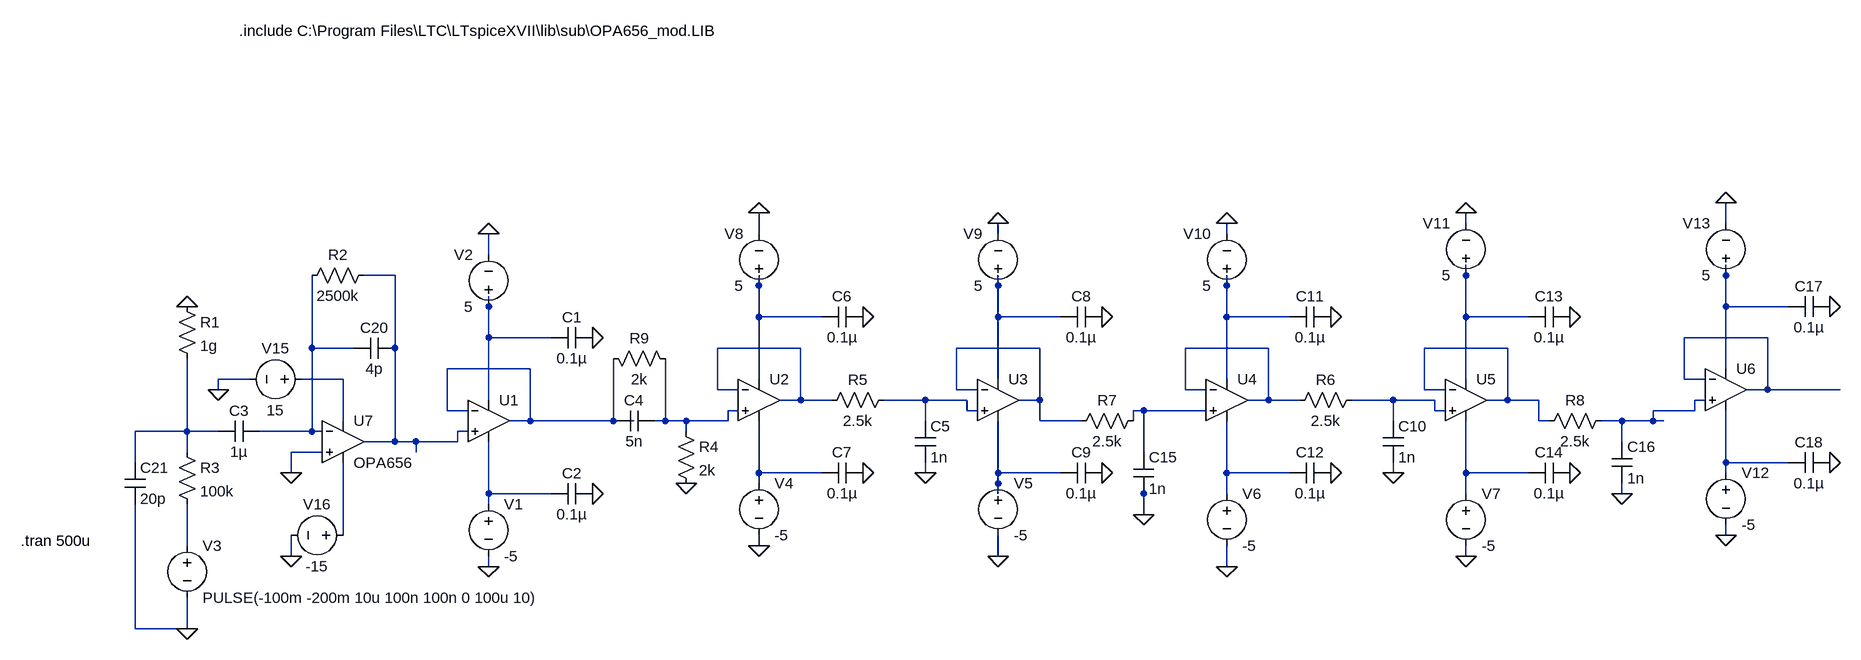
[diagram p0: schematic RF_CSP_pulseshaper.asc]
RF_CSP_pulseshaper.asc, the LTspice schematic file:
Version 4
SHEET 1 2596 1140
WIRE 1648 -224 1648 -240
WIRE 2048 -224 2048 -256
WIRE 560 -208 560 -240
WIRE 928 -208 928 -224
WIRE 1280 -208 1280 -224
WIRE 144 -176 144 -208
WIRE 0 -144 -48 -144
WIRE 1648 -144 1648 -160
WIRE 2048 -144 2048 -160
WIRE 560 -128 560 -144
WIRE 928 -128 928 -144
WIRE 1280 -128 1280 -144
WIRE 144 -96 144 -112
WIRE 2048 -96 2048 -144
WIRE 2144 -96 2048 -96
WIRE 560 -80 560 -128
WIRE 656 -80 560 -80
WIRE 928 -80 928 -128
WIRE 1024 -80 928 -80
WIRE 1280 -80 1280 -128
WIRE 1376 -80 1280 -80
WIRE 1648 -80 1648 -144
WIRE 1744 -80 1648 -80
WIRE 144 -48 144 -96
WIRE 240 -48 144 -48
WIRE 2112 -48 1984 -48
WIRE -128 -32 -128 -144
WIRE -64 -32 -128 -32
WIRE 0 -32 0 -144
WIRE 624 -32 496 -32
WIRE 992 -32 864 -32
WIRE 1344 -32 1216 -32
WIRE 1712 -32 1584 -32
WIRE 208 0 80 0
WIRE 2048 0 2048 -96
WIRE -224 16 -272 16
WIRE -80 16 -144 16
WIRE 560 16 560 -80
WIRE 928 16 928 -80
WIRE 1280 16 1280 -80
WIRE 1648 16 1648 -80
WIRE 1984 16 1984 -48
WIRE 2016 16 1984 16
WIRE -272 32 -272 16
WIRE 496 32 496 -32
WIRE 528 32 496 32
WIRE 864 32 864 -32
WIRE 896 32 864 32
WIRE 1216 32 1216 -32
WIRE 1248 32 1216 32
WIRE 1584 32 1584 -32
WIRE 1616 32 1584 32
WIRE 2112 32 2112 -48
WIRE 2112 32 2080 32
WIRE 2224 32 2112 32
WIRE 144 48 144 -48
WIRE 624 48 624 -32
WIRE 624 48 592 48
WIRE 672 48 624 48
WIRE 816 48 752 48
WIRE 880 48 816 48
WIRE 992 48 992 -32
WIRE 992 48 960 48
WIRE 1344 48 1344 -32
WIRE 1344 48 1312 48
WIRE 1392 48 1344 48
WIRE 1536 48 1472 48
WIRE 1600 48 1536 48
WIRE 1712 48 1712 -32
WIRE 1712 48 1680 48
WIRE 1760 48 1712 48
WIRE 2016 48 2000 48
WIRE 80 64 80 0
WIRE 112 64 80 64
WIRE 528 64 512 64
WIRE 880 64 880 48
WIRE 896 64 880 64
WIRE 1152 64 1136 64
WIRE 1248 64 1152 64
WIRE 1600 64 1600 48
WIRE 1616 64 1600 64
WIRE 2000 64 2000 48
WIRE 2000 64 1936 64
WIRE -80 80 -80 16
WIRE 208 80 208 0
WIRE 208 80 176 80
WIRE 336 80 336 -16
WIRE 336 80 208 80
WIRE 368 80 336 80
WIRE 416 80 416 -16
WIRE 416 80 400 80
WIRE 448 80 416 80
WIRE 512 80 512 64
WIRE 512 80 448 80
WIRE 816 80 816 48
WIRE 992 80 992 48
WIRE 1056 80 992 80
WIRE 1136 80 1136 64
WIRE 1536 80 1536 48
WIRE 1760 80 1760 48
WIRE 1776 80 1760 80
WIRE 1888 80 1856 80
WIRE 1936 80 1936 64
WIRE 1936 80 1888 80
WIRE 1952 80 1936 80
WIRE -320 96 -320 -16
WIRE -320 96 -400 96
WIRE -272 96 -320 96
WIRE -128 96 -128 -32
WIRE -128 96 -208 96
WIRE -112 96 -128 96
WIRE 112 96 96 96
WIRE 448 96 448 80
WIRE 0 112 0 -32
WIRE 0 112 -48 112
WIRE 32 112 0 112
WIRE 96 112 96 96
WIRE 96 112 32 112
WIRE 1888 112 1888 80
WIRE -320 128 -320 96
WIRE -112 128 -160 128
WIRE 32 128 32 112
WIRE 1152 128 1152 64
WIRE -400 144 -400 96
WIRE 2048 144 2048 64
WIRE 2144 144 2048 144
WIRE -160 160 -160 128
WIRE 560 160 560 80
WIRE 656 160 560 160
WIRE 816 160 816 144
WIRE 928 160 928 80
WIRE 1024 160 928 160
WIRE 1280 160 1280 80
WIRE 1376 160 1280 160
WIRE 1536 160 1536 144
WIRE 1648 160 1648 80
WIRE 1744 160 1648 160
WIRE 2048 160 2048 144
WIRE 560 176 560 160
WIRE 928 176 928 160
WIRE 144 192 144 112
WIRE 240 192 144 192
WIRE 928 192 928 176
WIRE 1152 192 1152 176
WIRE 1280 192 1280 160
WIRE 1648 192 1648 160
WIRE 1888 192 1888 176
WIRE 144 208 144 192
WIRE 1152 224 1152 192
WIRE -80 256 -80 144
WIRE 2048 256 2048 240
WIRE -320 272 -320 208
WIRE 560 272 560 256
WIRE -160 288 -160 256
WIRE 928 288 928 256
WIRE 1648 288 1648 272
WIRE 144 304 144 288
WIRE 1280 304 1280 272
WIRE -400 400 -400 208
WIRE -320 400 -320 352
WIRE -320 400 -400 400
FLAG 720 -80 0
FLAG 720 160 0
FLAG 816 160 0
FLAG 448 176 0
FLAG 1088 -80 0
FLAG 1440 -80 0
FLAG 1440 160 0
FLAG 1536 160 0
FLAG 1808 -80 0
FLAG 1808 160 0
FLAG 560 272 0
FLAG 928 288 0
FLAG 1280 304 0
FLAG 1648 288 0
FLAG 928 -224 0
FLAG 1280 -224 0
FLAG 1648 -240 0
FLAG 560 -240 0
FLAG 1088 160 0
FLAG 1152 224 0
FLAG 1888 192 0
FLAG 304 -48 0
FLAG 304 192 0
FLAG 144 304 0
FLAG 144 -208 0
FLAG -320 400 0
FLAG -320 -96 0
FLAG -160 160 0
FLAG -272 32 0
FLAG -160 288 0
FLAG 2208 -96 0
FLAG 2208 144 0
FLAG 2048 256 0
FLAG 2048 -256 0
SYMBOL cap 400 64 R90
WINDOW 0 0 32 VBottom 2
WINDOW 3 32 32 VTop 2
SYMATTR InstName C4
SYMATTR Value 5n
SYMBOL res 432 80 R0
SYMATTR InstName R4
SYMATTR Value 2k
SYMBOL res 768 32 R90
WINDOW 0 0 56 VBottom 2
WINDOW 3 32 56 VTop 2
SYMATTR InstName R5
SYMATTR Value 2.5k
SYMBOL cap 800 80 R0
SYMATTR InstName C5
SYMATTR Value 1n
SYMBOL cap 720 -96 R90
WINDOW 0 0 32 VBottom 2
WINDOW 3 32 32 VTop 2
SYMATTR InstName C6
SYMATTR Value 0.1µ
SYMBOL cap 720 144 R90
WINDOW 0 0 32 VBottom 2
WINDOW 3 32 32 VTop 2
SYMATTR InstName C7
SYMATTR Value 0.1µ
SYMBOL OpAmps\\UniversalOpamp2 560 48 R0
SYMATTR InstName U2
SYMBOL cap 1088 -96 R90
WINDOW 0 0 32 VBottom 2
WINDOW 3 32 32 VTop 2
SYMATTR InstName C8
SYMATTR Value 0.1µ
SYMBOL cap 1088 144 R90
WINDOW 0 0 32 VBottom 2
WINDOW 3 32 32 VTop 2
SYMATTR InstName C9
SYMATTR Value 0.1µ
SYMBOL OpAmps\\UniversalOpamp2 928 48 R0
SYMATTR InstName U3
SYMBOL res 1488 32 R90
WINDOW 0 0 56 VBottom 2
WINDOW 3 32 56 VTop 2
SYMATTR InstName R6
SYMATTR Value 2.5k
SYMBOL cap 1520 80 R0
SYMATTR InstName C10
SYMATTR Value 1n
SYMBOL cap 1440 -96 R90
WINDOW 0 0 32 VBottom 2
WINDOW 3 32 32 VTop 2
SYMATTR InstName C11
SYMATTR Value 0.1µ
SYMBOL cap 1440 144 R90
WINDOW 0 0 32 VBottom 2
WINDOW 3 32 32 VTop 2
SYMATTR InstName C12
SYMATTR Value 0.1µ
SYMBOL OpAmps\\UniversalOpamp2 1280 48 R0
SYMATTR InstName U4
SYMBOL cap 1808 -96 R90
WINDOW 0 0 32 VBottom 2
WINDOW 3 32 32 VTop 2
SYMATTR InstName C13
SYMATTR Value 0.1µ
SYMBOL cap 1808 144 R90
WINDOW 0 0 32 VBottom 2
WINDOW 3 32 32 VTop 2
SYMATTR InstName C14
SYMATTR Value 0.1µ
SYMBOL OpAmps\\UniversalOpamp2 1648 48 R0
SYMATTR InstName U5
SYMBOL voltage 560 160 R0
WINDOW 123 0 0 Left 0
WINDOW 39 0 0 Left 0
SYMATTR InstName V4
SYMATTR Value -5
SYMBOL voltage 928 160 R0
WINDOW 123 0 0 Left 0
WINDOW 39 0 0 Left 0
SYMATTR InstName V5
SYMATTR Value -5
SYMBOL voltage 1280 176 R0
WINDOW 123 0 0 Left 0
WINDOW 39 0 0 Left 0
SYMATTR InstName V6
SYMATTR Value -5
SYMBOL voltage 1648 176 R0
WINDOW 123 0 0 Left 0
WINDOW 39 0 0 Left 0
SYMATTR InstName V7
SYMATTR Value -5
SYMBOL voltage 560 -112 R180
WINDOW 0 24 96 Left 2
WINDOW 3 24 16 Left 2
WINDOW 123 0 0 Left 0
WINDOW 39 0 0 Left 0
SYMATTR InstName V8
SYMATTR Value 5
SYMBOL voltage 928 -112 R180
WINDOW 0 24 96 Left 2
WINDOW 3 24 16 Left 2
WINDOW 123 0 0 Left 0
WINDOW 39 0 0 Left 0
SYMATTR InstName V9
SYMATTR Value 5
SYMBOL voltage 1280 -112 R180
WINDOW 0 24 96 Left 2
WINDOW 3 24 16 Left 2
WINDOW 123 0 0 Left 0
WINDOW 39 0 0 Left 0
SYMATTR InstName V10
SYMATTR Value 5
SYMBOL voltage 1648 -128 R180
WINDOW 0 24 96 Left 2
WINDOW 3 24 16 Left 2
WINDOW 123 0 0 Left 0
WINDOW 39 0 0 Left 0
SYMATTR InstName V11
SYMATTR Value 5
SYMBOL res 1152 64 R90
WINDOW 0 0 56 VBottom 2
WINDOW 3 32 56 VTop 2
SYMATTR InstName R7
SYMATTR Value 2.5k
SYMBOL cap 1136 128 R0
SYMATTR InstName C15
SYMATTR Value 1n
SYMBOL cap 1872 112 R0
SYMATTR InstName C16
SYMATTR Value 1n
SYMBOL res 1872 64 R90
WINDOW 0 0 56 VBottom 2
WINDOW 3 32 56 VTop 2
SYMATTR InstName R8
SYMATTR Value 2.5k
SYMBOL cap 304 -64 R90
WINDOW 0 0 32 VBottom 2
WINDOW 3 32 32 VTop 2
SYMATTR InstName C1
SYMATTR Value 0.1µ
SYMBOL cap 304 176 R90
WINDOW 0 0 32 VBottom 2
WINDOW 3 32 32 VTop 2
SYMATTR InstName C2
SYMATTR Value 0.1µ
SYMBOL OpAmps\\UniversalOpamp2 144 80 R0
SYMATTR InstName U1
SYMBOL voltage 144 192 R0
WINDOW 123 0 0 Left 0
WINDOW 39 0 0 Left 0
SYMATTR InstName V1
SYMATTR Value -5
SYMBOL voltage 144 -80 R180
WINDOW 0 24 96 Left 2
WINDOW 3 24 16 Left 2
WINDOW 123 0 0 Left 0
WINDOW 39 0 0 Left 0
SYMATTR InstName V2
SYMATTR Value 5
SYMBOL voltage -320 256 R0
WINDOW 123 0 0 Left 0
WINDOW 39 0 0 Left 0
SYMATTR InstName V3
SYMATTR Value PULSE(-100m -200m 10u 100n 100n 0 100u 10)
SYMBOL res -336 -112 R0
SYMATTR InstName R1
SYMATTR Value 1g
SYMBOL OpAmps\\opamp2 -80 48 R0
SYMATTR InstName U7
SYMATTR Value OPA656
SYMBOL cap -208 80 R90
WINDOW 0 0 32 VBottom 2
WINDOW 3 32 32 VTop 2
SYMATTR InstName C3
SYMATTR Value 1µ
SYMBOL cap 0 -48 R90
WINDOW 0 0 32 VBottom 2
WINDOW 3 32 32 VTop 2
SYMATTR InstName C20
SYMATTR Value 4p
SYMBOL res -32 -160 R90
WINDOW 0 0 56 VBottom 2
WINDOW 3 32 56 VTop 2
SYMATTR InstName R2
SYMATTR Value 2500k
SYMBOL voltage -128 16 R90
WINDOW 0 -32 56 VBottom 2
WINDOW 3 32 56 VTop 2
WINDOW 123 0 0 Left 0
WINDOW 39 0 0 Left 0
SYMATTR InstName V15
SYMATTR Value 15
SYMBOL voltage -64 256 R90
WINDOW 0 -32 56 VBottom 2
WINDOW 3 32 56 VTop 2
WINDOW 123 0 0 Left 0
WINDOW 39 0 0 Left 0
SYMATTR InstName V16
SYMATTR Value -15
SYMBOL res -336 112 R0
SYMATTR InstName R3
SYMATTR Value 100k
SYMBOL cap -416 144 R0
SYMATTR InstName C21
SYMATTR Value 20p
SYMBOL res 320 -32 M90
WINDOW 0 0 56 VBottom 2
WINDOW 3 32 56 VTop 2
SYMATTR InstName R9
SYMATTR Value 2k
SYMBOL cap 2208 -112 R90
WINDOW 0 0 32 VBottom 2
WINDOW 3 32 32 VTop 2
SYMATTR InstName C17
SYMATTR Value 0.1µ
SYMBOL cap 2208 128 R90
WINDOW 0 0 32 VBottom 2
WINDOW 3 32 32 VTop 2
SYMATTR InstName C18
SYMATTR Value 0.1µ
SYMBOL OpAmps\\UniversalOpamp2 2048 32 R0
SYMATTR InstName U6
SYMBOL voltage 2048 144 R0
WINDOW 123 0 0 Left 0
WINDOW 39 0 0 Left 0
SYMATTR InstName V12
SYMATTR Value -5
SYMBOL voltage 2048 -128 R180
WINDOW 0 24 96 Left 2
WINDOW 3 24 16 Left 2
WINDOW 123 0 0 Left 0
WINDOW 39 0 0 Left 0
SYMATTR InstName V13
SYMATTR Value 5
TEXT -240 -520 Left 2 !.include C:\\Program Files\\LTC\\LTspiceXVII\\lib\\sub\\OPA656_mod.LIB
TEXT -576 264 Left 2 !.tran 500u

The netlist it stands for:
* RF_CSP_pulseshaper.asc
C4 N019 N014 5n
R4 N019 0 2k
R5 N016 N010 2.5k
C5 N016 0 1n
C6 0 N004 0.1µ
C7 0 N023 0.1µ
XU2 N019 N010 N004 N023 N010 level.2 Avol=1Meg GBW=10Meg Slew=10Meg ilimit=25m rail=0 Vos=0 phimargin=45 en=0 enk=0 in=0 ink=0 Rin=500Meg  ; pins IN+ IN- V+ V- OUT
C8 0 N005 0.1µ
C9 0 N024 0.1µ
XU3 N016 N011 N005 N024 N011 level.2 Avol=1Meg GBW=10Meg Slew=10Meg ilimit=25m rail=0 Vos=0 phimargin=45 en=0 enk=0 in=0 ink=0 Rin=500Meg  ; pins IN+ IN- V+ V- OUT
R6 N017 N012 2.5k
C10 N017 0 1n
C11 0 N006 0.1µ
C12 0 N025 0.1µ
XU4 N020 N012 N006 N025 N012 level.2 Avol=1Meg GBW=10Meg Slew=10Meg ilimit=25m rail=0 Vos=0 phimargin=45 en=0 enk=0 in=0 ink=0 Rin=500Meg  ; pins IN+ IN- V+ V- OUT
C13 0 N002 0.1µ
C14 0 N026 0.1µ
XU5 N017 N013 N002 N026 N013 level.2 Avol=1Meg GBW=10Meg Slew=10Meg ilimit=25m rail=0 Vos=0 phimargin=45 en=0 enk=0 in=0 ink=0 Rin=500Meg  ; pins IN+ IN- V+ V- OUT
V4 N023 0 -5
V5 N024 0 -5
V6 N025 0 -5
V7 N026 0 -5
V8 N004 0 5
V9 N005 0 5
V10 N006 0 5
V11 N002 0 5
R7 N020 N011 2.5k
C15 N020 0 1n
C16 N018 0 1n
R8 N018 N013 2.5k
C1 0 N007 0.1µ
C2 0 N027 0.1µ
XU1 N001 N014 N007 N027 N014 level.2 Avol=1Meg GBW=10Meg Slew=10Meg ilimit=25m rail=0 Vos=0 phimargin=45 en=0 enk=0 in=0 ink=0 Rin=500Meg  ; pins IN+ IN- V+ V- OUT
V1 N027 0 -5
V2 N007 0 5
V3 N029 0 PULSE(-100m -200m 10u 100n 100n 0 100u 10)
R1 0 N021 1g
XU7 0 N009 N015 N028 N001 OPA656  ; pins In+ In- V+ V- OUT
C3 N009 N021 1µ
C20 N001 N009 4p
R2 N001 N009 2500k
V15 N015 0 15
V16 N028 0 -15
R3 N021 N029 100k
C21 N021 0 20p
R9 N014 N019 2k
C17 0 N003 0.1µ
C18 0 N022 0.1µ
XU6 N018 N008 N003 N022 N008 level.2 Avol=1Meg GBW=10Meg Slew=10Meg ilimit=25m rail=0 Vos=0 phimargin=45 en=0 enk=0 in=0 ink=0 Rin=500Meg  ; pins IN+ IN- V+ V- OUT
V12 N022 0 -5
V13 N003 0 5
.include C:\Program Files\LTC\LTspiceXVII\lib\sub\OPA656_mod.LIB
.tran 500u
.lib UniversalOpamps2.sub
.backanno
.end